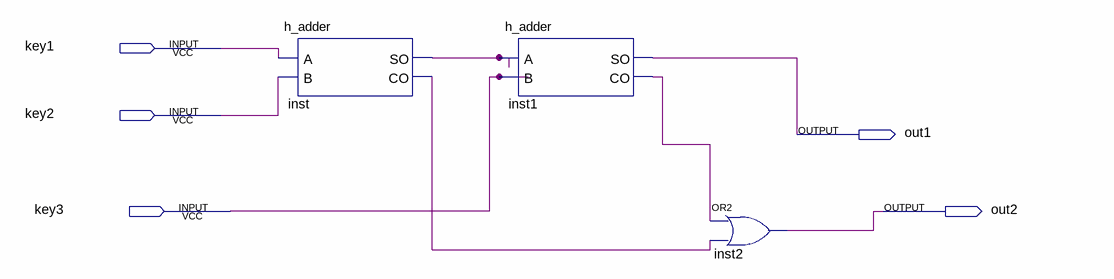
[diagram p0: schematic sheet]
// Quartus schematic fulladder.bdf as structural Verilog: 3 symbols, 5 pins
module fulladder (
  input  key1,
  input  key2,
  input  key3,
  output out1,
  output out2
);

  wire inst1_co, inst_co, inst_so;

  h_adder inst (.A(key1), .B(key2), .SO(inst_so), .CO(inst_co));
  h_adder inst1 (.A(inst_so), .B(key3), .SO(out1), .CO(inst1_co));
  or inst2 (out2, inst1_co, inst_co);
endmodule
